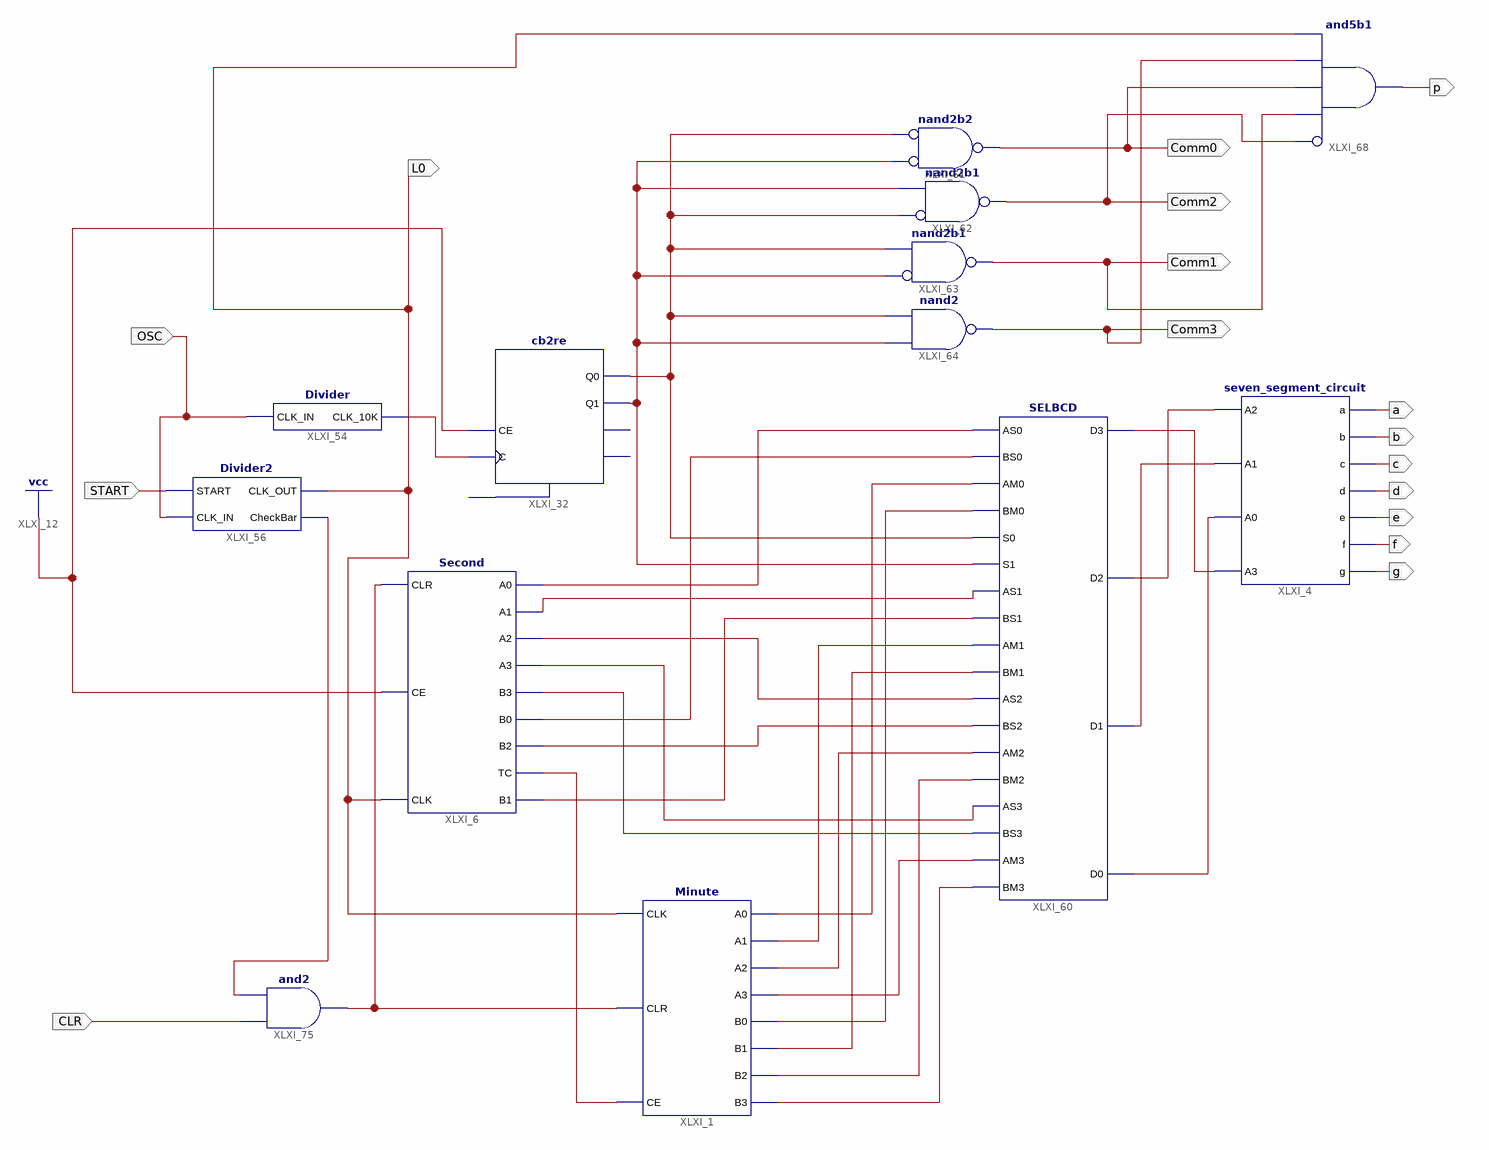
[diagram p0: schematic sheet 1]
// Xilinx ISE schematic Clock.sch (spartan6) as structural Verilog: 13 symbols, 16 ports
module Clock (
  input  OSC,
  input  START,
  input  CLR,
  output a,
  output b,
  output c,
  output d,
  output e,
  output f,
  output g,
  output Comm3,
  output Comm1,
  output Comm2,
  output Comm0,
  output L0,
  output p
);

  wire XLXN_46, XLXN_187, XLXN_200, XLXN_227, XLXN_228, XLXN_229, XLXN_230, XLXN_235, XLXN_236, XLXN_237,
       XLXN_238, XLXN_239, XLXN_240, XLXN_241, XLXN_242, XLXN_243, XLXN_244, XLXN_245, XLXN_246, XLXN_256,
       XLXN_257, XLXN_274, XLXN_275, XLXN_276, XLXN_305, XLXN_316;

  Second XLXI_6 (
    .CLR(XLXN_316), .CE(1'b1), .CLK(L0), .A0(XLXN_227), .A1(XLXN_228), .A2(XLXN_229), .A3(XLXN_230),
    .B3(XLXN_256), .B0(XLXN_274), .B2(XLXN_257), .TC(XLXN_275), .B1(XLXN_276));
  Minute XLXI_1 (
    .CLK(L0), .CLR(XLXN_316), .CE(XLXN_275), .A0(XLXN_235), .A1(XLXN_236), .A2(XLXN_237), .A3(XLXN_238),
    .B0(XLXN_239), .B1(XLXN_240), .B2(XLXN_241), .B3(XLXN_242));
  seven_segment_circuit XLXI_4 (
    .A2(XLXN_244), .A1(XLXN_245), .A0(XLXN_246), .A3(XLXN_243), .a(a), .b(b), .c(c), .d(d), .e(e), .f(f),
    .g(g));
  Divider XLXI_54 (.CLK_IN(OSC), .CLK_10K(XLXN_200));
  Divider2 XLXI_56 (.START(START), .CLK_IN(OSC), .CLK_OUT(L0), .CheckBar(XLXN_305));
  cb2re XLXI_32 (.C(XLXN_200), .CE(1'b1), .Q0(XLXN_187), .Q1(XLXN_46));  // open: R, CEO, TC
  SELBCD XLXI_60 (
    .AS0(XLXN_227), .BS0(XLXN_274), .AM0(XLXN_235), .BM0(XLXN_239), .S0(XLXN_187), .S1(XLXN_46),
    .AS1(XLXN_228), .BS1(XLXN_276), .AM1(XLXN_236), .BM1(XLXN_240), .AS2(XLXN_229), .BS2(XLXN_257),
    .AM2(XLXN_237), .BM2(XLXN_241), .AS3(XLXN_230), .BS3(XLXN_256), .AM3(XLXN_238), .BM3(XLXN_242),
    .D3(XLXN_243), .D2(XLXN_244), .D1(XLXN_245), .D0(XLXN_246));
  nand XLXI_61 (Comm0, ~XLXN_46, ~XLXN_187);  // nand2b2
  nand XLXI_62 (Comm2, ~XLXN_187, XLXN_46);  // nand2b1
  nand XLXI_63 (Comm1, ~XLXN_46, XLXN_187);  // nand2b1
  nand XLXI_64 (Comm3, XLXN_46, XLXN_187);
  and XLXI_68 (p, ~Comm2, Comm1, Comm0, Comm3, L0);  // and5b1
  and XLXI_75 (XLXN_316, CLR, XLXN_305);

  // Notes on the sheet:
  //   LOC on signal a = P41
  //   LOC on signal b = P40
  //   LOC on signal c = P35
  //   LOC on signal d = P34
  //   LOC on signal e = P32
  //   LOC on signal f = P29
  //   LOC on signal g = P27
  //   LOC on signal OSC = P123
  //   LOC on signal Comm3 = P30
  //   LOC on signal Comm1 = P43
  //   LOC on signal Comm2 = P33
  //   LOC on signal Comm0 = P44
  //   LOC on signal L0 = P84
  //   LOC on signal START = P45
  //   CLOCK_DEDICATED_ROUTE on signal START = TRUE
  //   LOC on signal p = P26
  //   LOC on signal CLR = P46
endmodule
